# EAGLE schematic psg-dual-ad9833 (EAGLE 6.6.0)
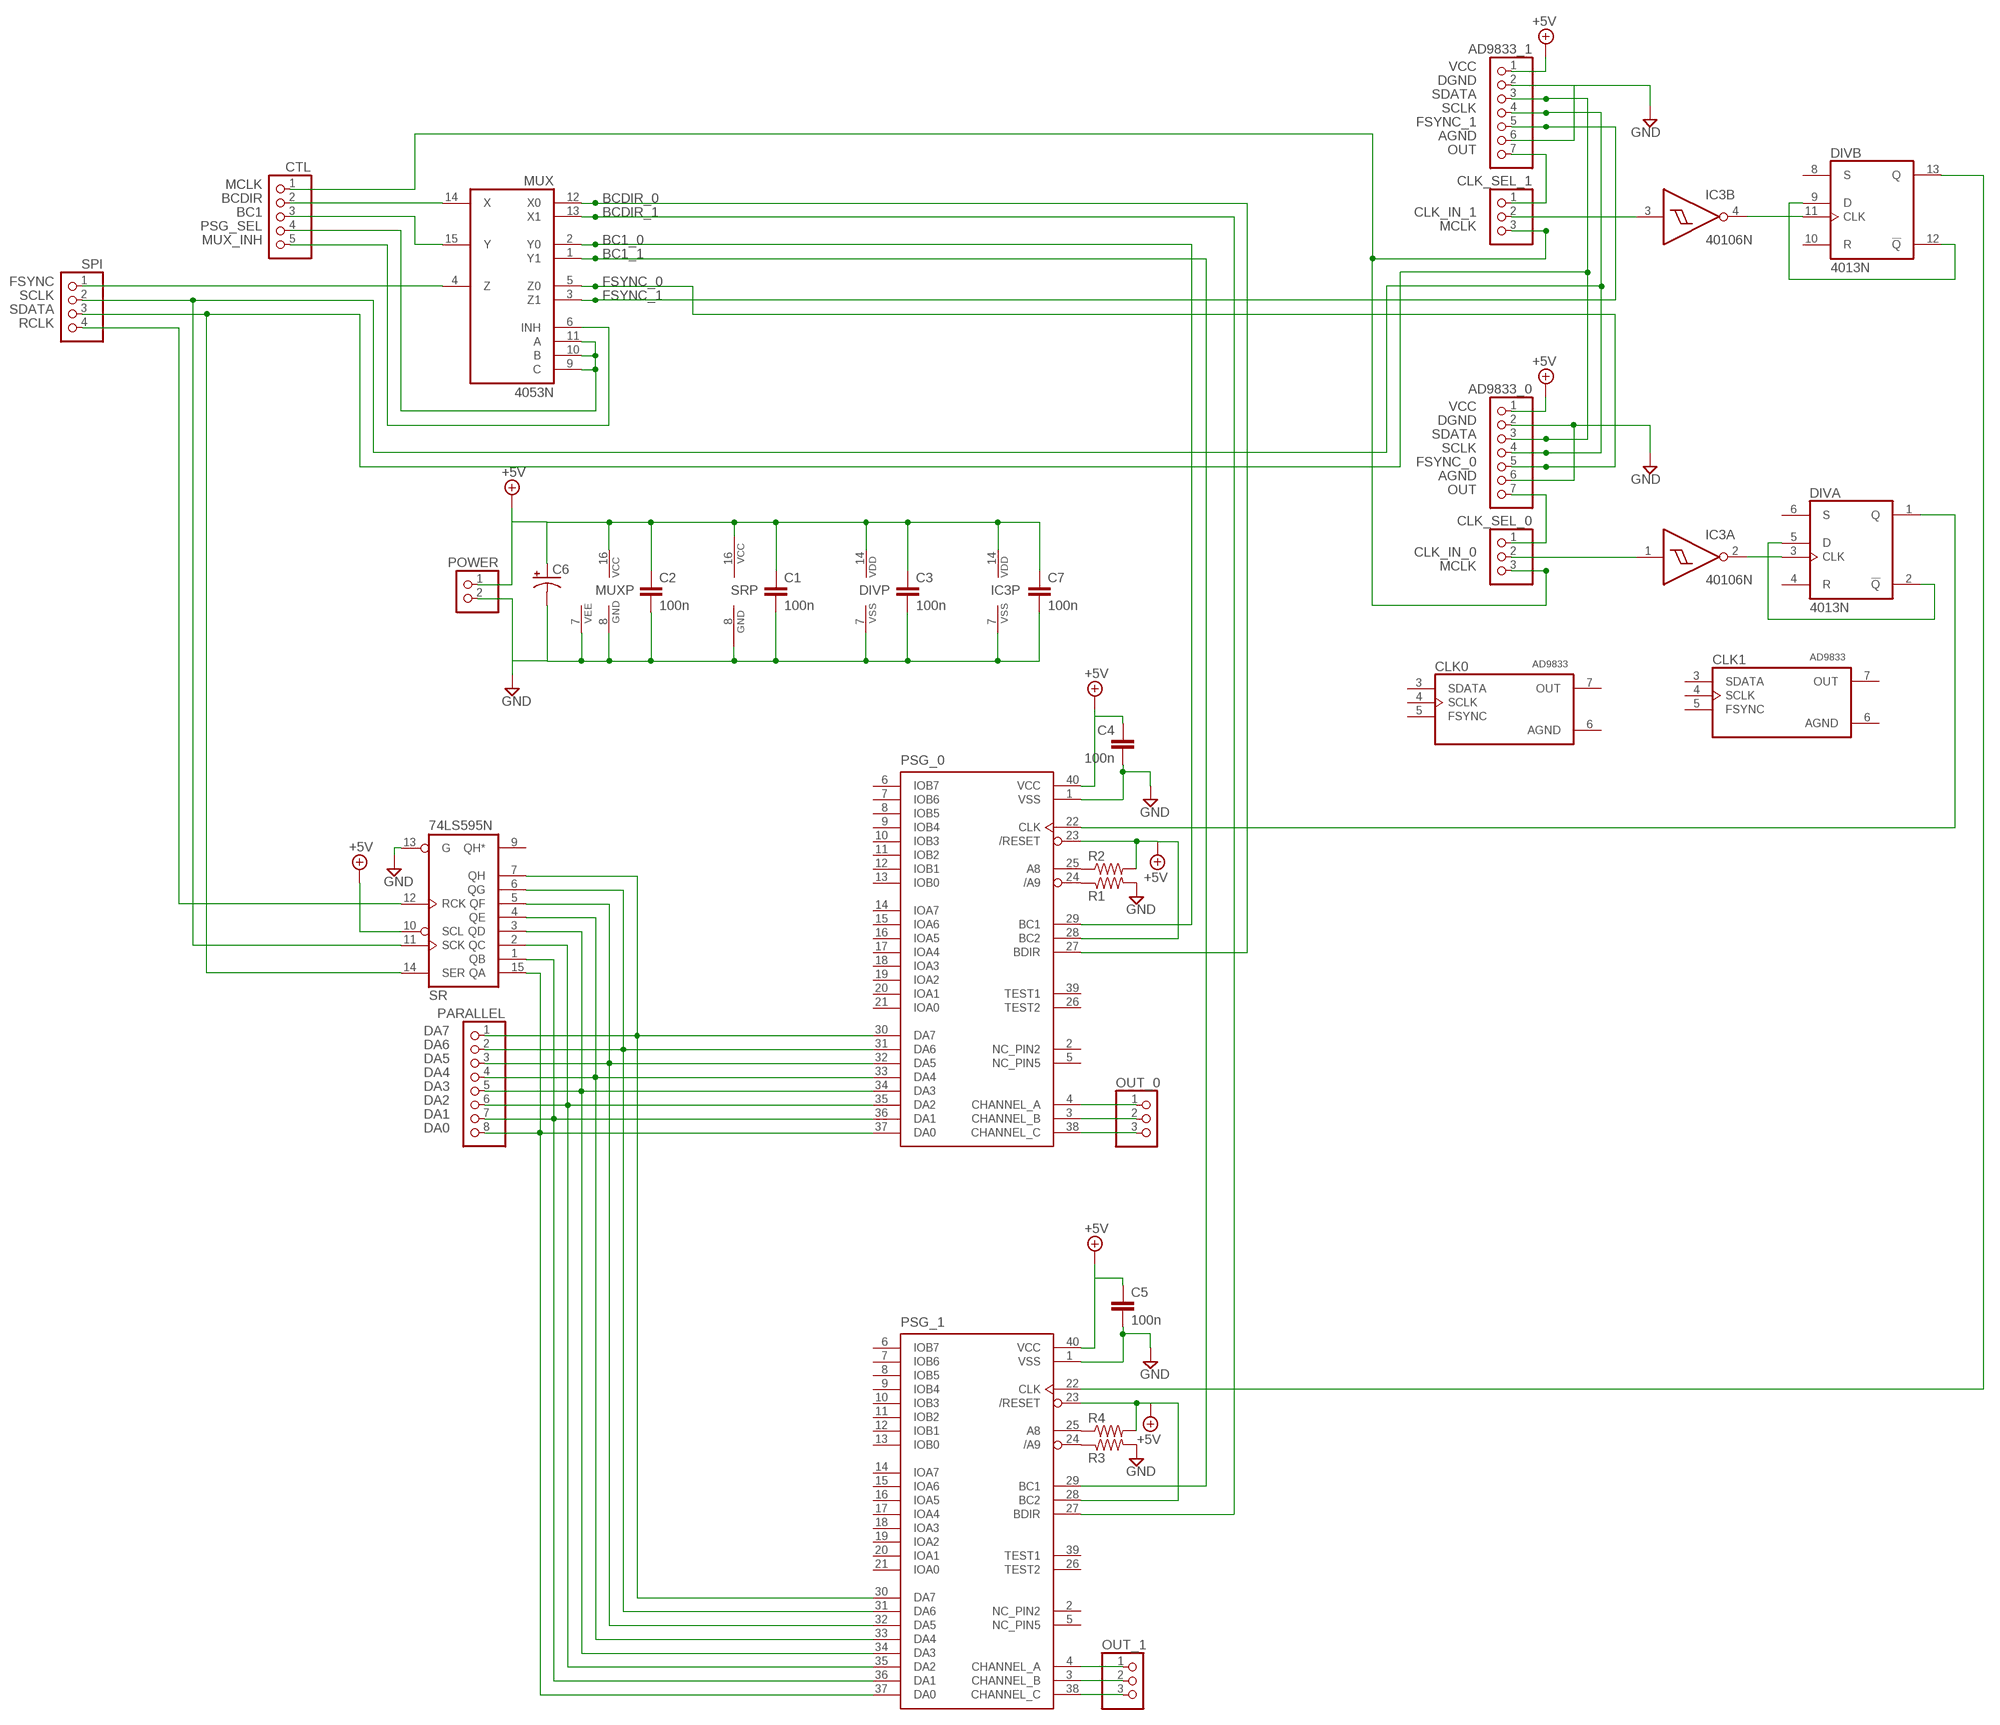
[diagram p0: schematic, sheet 1]

## Parts
AD9833_0  PINHD-1X7  [1X07]
AD9833_1  PINHD-1X7  [1X07]
C1  100n  050X030_0251  [050X030_025]
C2  100n  050X030_0251  [050X030_025]
C3  100n  050X030_0251  [050X030_025]
C4  100n  050X030_0253  [050X030_025_3]
C5  100n  050X030_0253  [050X030_025_3]
C6  0501  [050_020_1]
C7  100n  050X030_0251  [050X030_025]
CLK0  AD9833_MODULE  [AD9833_MODULE]
CLK1  AD9833_MODULE  [AD9833_MODULE]
CLK_SEL_0  PINHD-1X3  [1X03]
CLK_SEL_1  PINHD-1X3  [1X03]
CTL  PINHD-1X5  [1X05]
DIV  4013N  [DIL14]
IC3  40106N  [DIL14]
MUX  4053N  [DIL16]
OUT_0  PINHD-1X3  [1X03]
OUT_1  PINHD-1X3  [1X03]
PARALLEL  PINHD-1X8  [1X08]
POWER  PINHD-1X2  [1X02]
PSG_0  AY-3-8910  [DIL40]
PSG_1  AY-3-8910  [DIL40]
R1  6MM.3  [R0207/3]
R2  6MM.3  [R0207/3]
R3  6MM.3  [R0207/3]
R4  6MM.3  [R0207/3]
SPI  PINHD-1X4  [1X04]
SR  74LS595N  [DIL16]

## Nets
+5V: AD9833_0.1 AD9833_1.1 C1.1 C2.1 C3.1 C4.1 C5.1 C6.+ C7.1 DIV.14(P:VDD) IC3.14(P:VDD) MUX.16(VCC) POWER.1 PSG_0.23(/RESET) PSG_0.28(BC2) PSG_0.40(VCC) PSG_1.23(/RESET) PSG_1.28(BC2) PSG_1.40(VCC) R2.2 R4.2 SR.10(SCL) SR.16(VCC)
BC1: CTL.3 MUX.15(Y)
BC1_0: MUX.2(Y0) PSG_0.29(BC1)
BC1_1: MUX.1(Y1) PSG_1.29(BC1)
BCDIR: CTL.2 MUX.14(X)
BCDIR_0: MUX.12(X0) PSG_0.27(BDIR)
BCDIR_1: MUX.13(X1) PSG_1.27(BDIR)
CLK_0: DIV.1(A:Q) PSG_0.22(CLK)
CLK_1: DIV.13(B:Q) PSG_1.22(CLK)
CLK_IN_0: CLK_SEL_0.2 IC3.1(A:I)
CLK_IN_1: CLK_SEL_1.2 IC3.3(B:I)
DA0: PARALLEL.8 PSG_0.37(DA0) PSG_1.37(DA0) SR.15(QA)
DA1: PARALLEL.7 PSG_0.36(DA1) PSG_1.36(DA1) SR.1(QB)
DA2: PARALLEL.6 PSG_0.35(DA2) PSG_1.35(DA2) SR.2(QC)
DA3: PARALLEL.5 PSG_0.34(DA3) PSG_1.34(DA3) SR.3(QD)
DA4: PARALLEL.4 PSG_0.33(DA4) PSG_1.33(DA4) SR.4(QE)
DA5: PARALLEL.3 PSG_0.32(DA5) PSG_1.32(DA5) SR.5(QF)
DA6: PARALLEL.2 PSG_0.31(DA6) PSG_1.31(DA6) SR.6(QG)
DA7: PARALLEL.1 PSG_0.30(DA7) PSG_1.30(DA7) SR.7(QH)
FSYNC: MUX.4(Z) SPI.1
FSYNC_0: AD9833_0.5 MUX.5(Z0)
FSYNC_1: AD9833_1.5 MUX.3(Z1)
GND: AD9833_0.2 AD9833_0.6 AD9833_1.2 AD9833_1.6 C1.2 C2.2 C3.2 C4.2 C5.2 C6.- C7.2 DIV.7(P:VSS) IC3.7(P:VSS) MUX.7(VEE) MUX.8(GND) POWER.2 PSG_0.1(VSS) PSG_1.1(VSS) R1.2 R3.2 SR.8(GND) SR.13(G)
MCLK: CLK_SEL_0.3 CLK_SEL_1.3 CTL.1
MUX_INH: CTL.5 MUX.6(INH)
N$1: OUT_0.1 PSG_0.4(CHANNEL_A)
N$3: OUT_0.2 PSG_0.3(CHANNEL_B)
N$4: OUT_0.3 PSG_0.38(CHANNEL_C)
N$5: AD9833_1.7 CLK_SEL_1.1
N$6: AD9833_0.7 CLK_SEL_0.1
N$7: DIV.11(B:CLK) IC3.4(B:O)
N$8: DIV.9(B:D) DIV.12(B:!Q)
N$9: OUT_1.1 PSG_1.4(CHANNEL_A)
N$10: OUT_1.2 PSG_1.3(CHANNEL_B)
N$11: OUT_1.3 PSG_1.38(CHANNEL_C)
N$12: PSG_1.25(A8) R4.1
N$13: PSG_1.24(/A9) R3.1
N$14: PSG_0.24(/A9) R1.1
N$15: PSG_0.25(A8) R2.1
N$17: DIV.3(A:CLK) IC3.2(A:O)
N$18: DIV.2(A:!Q) DIV.5(A:D)
PSG_SEL: CTL.4 MUX.9(C) MUX.10(B) MUX.11(A)
RCLK: SPI.4 SR.12(RCK)
SCLK: AD9833_0.4 AD9833_1.4 SPI.2 SR.11(SCK)
SDATA: AD9833_0.3 AD9833_1.3 SPI.3 SR.14(SER)
Unconnected: CLK0.3(SDATA) CLK0.4(SCLK) CLK0.5(FSYNC) CLK0.7(OUT) CLK1.3(SDATA) CLK1.4(SCLK) CLK1.5(FSYNC) CLK1.7(OUT) DIV.4(A:R) DIV.6(A:S) DIV.8(B:S) DIV.10(B:R) IC3.5(C:I) IC3.6(C:O) IC3.8(D:O) IC3.9(D:I) IC3.10(E:O) IC3.11(E:I) IC3.12(F:O) IC3.13(F:I) PSG_0.2(NC_PIN2) PSG_0.5(NC_PIN5) PSG_0.6(IOB7) PSG_0.7(IOB6) PSG_0.8(IOB5) PSG_0.9(IOB4) PSG_0.10(IOB3) PSG_0.11(IOB2) PSG_0.12(IOB1) PSG_0.13(IOB0) PSG_0.14(IOA7) PSG_0.15(IOA6) PSG_0.16(IOA5) PSG_0.17(IOA4) PSG_0.18(IOA3) PSG_0.19(IOA2) PSG_0.20(IOA1) PSG_0.21(IOA0) PSG_0.26(TEST2) PSG_0.39(TEST1) PSG_1.2(NC_PIN2) PSG_1.5(NC_PIN5) PSG_1.6(IOB7) PSG_1.7(IOB6) PSG_1.8(IOB5) PSG_1.9(IOB4) PSG_1.10(IOB3) PSG_1.11(IOB2) PSG_1.12(IOB1) PSG_1.13(IOB0) PSG_1.14(IOA7) PSG_1.15(IOA6) PSG_1.16(IOA5) PSG_1.17(IOA4) PSG_1.18(IOA3) PSG_1.19(IOA2) PSG_1.20(IOA1) PSG_1.21(IOA0) PSG_1.26(TEST2) PSG_1.39(TEST1) SR.9(QH*)

## Notes on the sheet
- VCC
- DGND
- AGND
- OUT
- VCC
- DGND
- AGND
- OUT

## Power pins joined to a net without a drawn wire
+V: CLK0.1(+V) CLK1.1(+V)
AGND: CLK0.6(AGND) CLK1.6(AGND)
GND: CLK0.2(GND) CLK1.2(GND)

## Library data of the parts
AD9833_0 AD9833_1 = pinhead:PINHD-1X7: PIN HEADER
C1-C5 C7 = gm-caps-ceramic:050X030_025: 47 - 120pF Xicon Ceramic Disc 2.5mm lead spacing
C6 = gm-caps-electro-pol:050: 0.22 - 100uF Xicon values at Mouser.com: 10V: 10 - 100uF; 16V: 2.2 - 47uF; 25V: 0.47 - 47uF; 50V: 0.22 - 22uF
CLK0 CLK1 = jaapie:AD9833_MODULE
CLK_SEL_0 CLK_SEL_1 OUT_0 OUT_1 = pinhead:PINHD-1X3: PIN HEADER
CTL = pinhead:PINHD-1X5: PIN HEADER
DIV = 40xx:4013: Dual D FLIP FLOP, set/reset
IC3 = 40xx:40106: Hex SCHMITT TRIGGER
MUX = 40xx:4053: Triple 2-channel ANALOG MULTIPLEXER
PARALLEL = pinhead:PINHD-1X8: PIN HEADER
POWER = pinhead:PINHD-1X2: PIN HEADER
PSG_0 PSG_1 = 8Bit_Parts:AY-3-8910
R1-R4 = gm-resistors:6MM: 6mm Resistors Leads spaced 1-6 holes apart for 0.1" perfboard. Suitable for 1/4 watt resistors.
SPI = pinhead:PINHD-1X4: PIN HEADER
SR = 74xx-us:74*595: 8-bit SHIFT REGISTER, output latch